# EAGLE schematic Ex Controller (EAGLE 7.4.0)
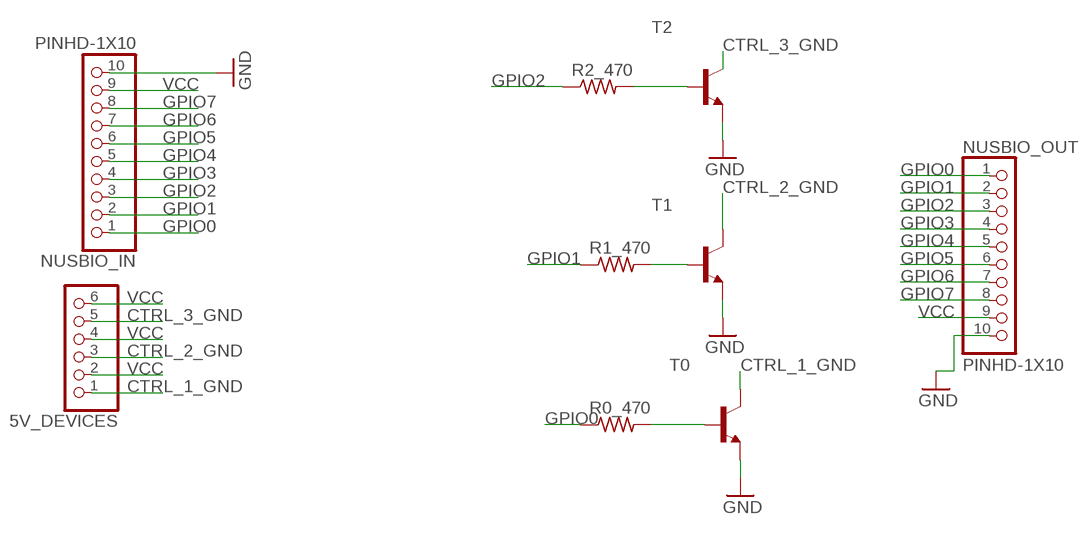
[diagram p0: schematic, sheet 1]

## Parts
5V_DEVICES  PINHD-1X6  [1X06]
NUSBIO_IN  PINHD-1X10  [1X10-BIG]
NUSBIO_OUT  PINHD-1X10  [1X10-BIG]
R0_470  R-US_R0805  [R0805]
R1_470  R-US_R0805  [R0805]
R2_470  R-US_R0805  [R0805]
T0  MMBT3904LT1-NPN-SOT23-BEC  [SOT23-BEC]
T1  MMBT3904LT1-NPN-SOT23-BEC  [SOT23-BEC]
T2  MMBT3904LT1-NPN-SOT23-BEC  [SOT23-BEC]

## Nets
CTRL_1_GND: 5V_DEVICES.1 T0.C
CTRL_2_GND: 5V_DEVICES.3 T1.C
CTRL_3_GND: 5V_DEVICES.5 T2.C
GND: NUSBIO_IN.10 NUSBIO_OUT.10 T0.E T1.E T2.E
GPIO0: NUSBIO_IN.1 NUSBIO_OUT.1 R0_470.1
GPIO1: NUSBIO_IN.2 NUSBIO_OUT.2 R1_470.1
GPIO2: NUSBIO_IN.3 NUSBIO_OUT.3 R2_470.1
GPIO3: NUSBIO_IN.4 NUSBIO_OUT.4
GPIO4: NUSBIO_IN.5 NUSBIO_OUT.5
GPIO5: NUSBIO_IN.6 NUSBIO_OUT.6
GPIO6: NUSBIO_IN.7 NUSBIO_OUT.7
GPIO7: NUSBIO_IN.8 NUSBIO_OUT.8
N$1: R2_470.2 T2.B
N$2: R1_470.2 T1.B
N$3: R0_470.2 T0.B
VCC: 5V_DEVICES.2 5V_DEVICES.4 5V_DEVICES.6 NUSBIO_IN.9 NUSBIO_OUT.9

## Library data of the parts
5V_DEVICES = adafruit:PINHD-1X6: PIN HEADER
NUSBIO_IN NUSBIO_OUT = adafruit:PINHD-1X10: Pin header 1x10 0.1" spacing With round pins
R0_470 R1_470 R2_470 = adafruit:R-US_: RESISTOR, American symbol
T0 T1 T2 = transistor:*-NPN-: NPN Transistror BF959 corrected 2008.03.06